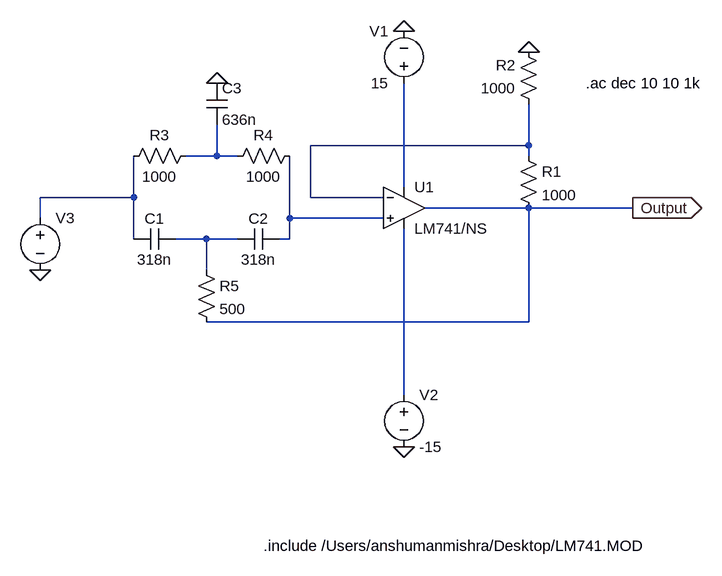
[diagram p0: schematic Band_Reject.asc]
Band_Reject.asc, the LTspice schematic file:
Version 4
SHEET 1 912 824
WIRE 592 192 592 128
WIRE 592 192 256 192
WIRE 112 208 112 160
WIRE 112 208 64 208
WIRE 144 208 112 208
WIRE 592 208 592 192
WIRE 400 256 400 96
WIRE -16 272 -16 208
WIRE -16 272 -160 272
WIRE 256 272 256 192
WIRE 368 272 256 272
WIRE 592 288 432 288
WIRE 752 288 592 288
WIRE -160 304 -160 272
WIRE 224 304 224 208
WIRE 368 304 224 304
WIRE -16 336 -16 272
WIRE 96 336 48 336
WIRE 144 336 96 336
WIRE 224 336 224 304
WIRE 224 336 208 336
WIRE 96 384 96 336
WIRE 592 464 592 288
WIRE 592 464 96 464
WIRE 400 576 400 320
FLAG 400 16 0
FLAG 400 656 0
FLAG 752 288 Output
IOPIN 752 288 Out
FLAG 592 48 0
FLAG 112 96 0
FLAG -160 384 0
SYMBOL opamp2 400 224 R0
SYMATTR InstName U1
SYMATTR Value LM741/NS
SYMBOL voltage 400 112 R180
WINDOW 0 24 96 Left 2
WINDOW 3 24 16 Left 2
SYMATTR InstName V1
SYMATTR Value 15
SYMBOL voltage 400 560 R0
SYMATTR InstName V2
SYMATTR Value -15
SYMBOL res 608 144 R180
WINDOW 0 36 76 Left 2
WINDOW 3 36 40 Left 2
SYMATTR InstName R2
SYMATTR Value 1000
SYMBOL res 80 368 R0
SYMATTR InstName R5
SYMATTR Value 500
SYMBOL cap 48 320 R90
WINDOW 0 0 32 VBottom 2
WINDOW 3 32 32 VTop 2
SYMATTR InstName C1
SYMATTR Value 318n
SYMBOL cap 208 320 R90
WINDOW 0 0 32 VBottom 2
WINDOW 3 32 32 VTop 2
SYMATTR InstName C2
SYMATTR Value 318n
SYMBOL res 80 192 R90
WINDOW 0 0 56 VBottom 2
WINDOW 3 32 56 VTop 2
SYMATTR InstName R3
SYMATTR Value 1000
SYMBOL res 240 192 R90
WINDOW 0 0 56 VBottom 2
WINDOW 3 32 56 VTop 2
SYMATTR InstName R4
SYMATTR Value 1000
SYMBOL cap 96 96 R0
SYMATTR InstName C3
SYMATTR Value 636n
SYMBOL voltage -160 288 R0
SYMATTR InstName V3
SYMATTR Value ""
SYMATTR Value2 AC 1 0
SYMBOL res 576 192 R0
SYMATTR InstName R1
SYMATTR Value 1000
TEXT 184 808 Left 2 !.include /Users/anshumanmishra/Desktop/LM741.MOD
TEXT 680 96 Left 2 !.ac dec 10 10 1k

The netlist it stands for:
* Band_Reject.asc
XU1 N005 N001 N003 N007 Output LM741/NS  ; pins In+ In- V+ V- OUT
V1 N003 0 15
V2 N007 0 -15
R2 N001 0 1000
R5 N006 Output 500
C1 N006 N004 318n
C2 N005 N006 318n
R3 N002 N004 1000
R4 N005 N002 1000
C3 0 N002 636n
V3 N004 0 AC 1 0
R1 N001 Output 1000
.include /Users/anshumanmishra/Desktop/LM741.MOD
.ac dec 10 10 1k
.backanno
.end